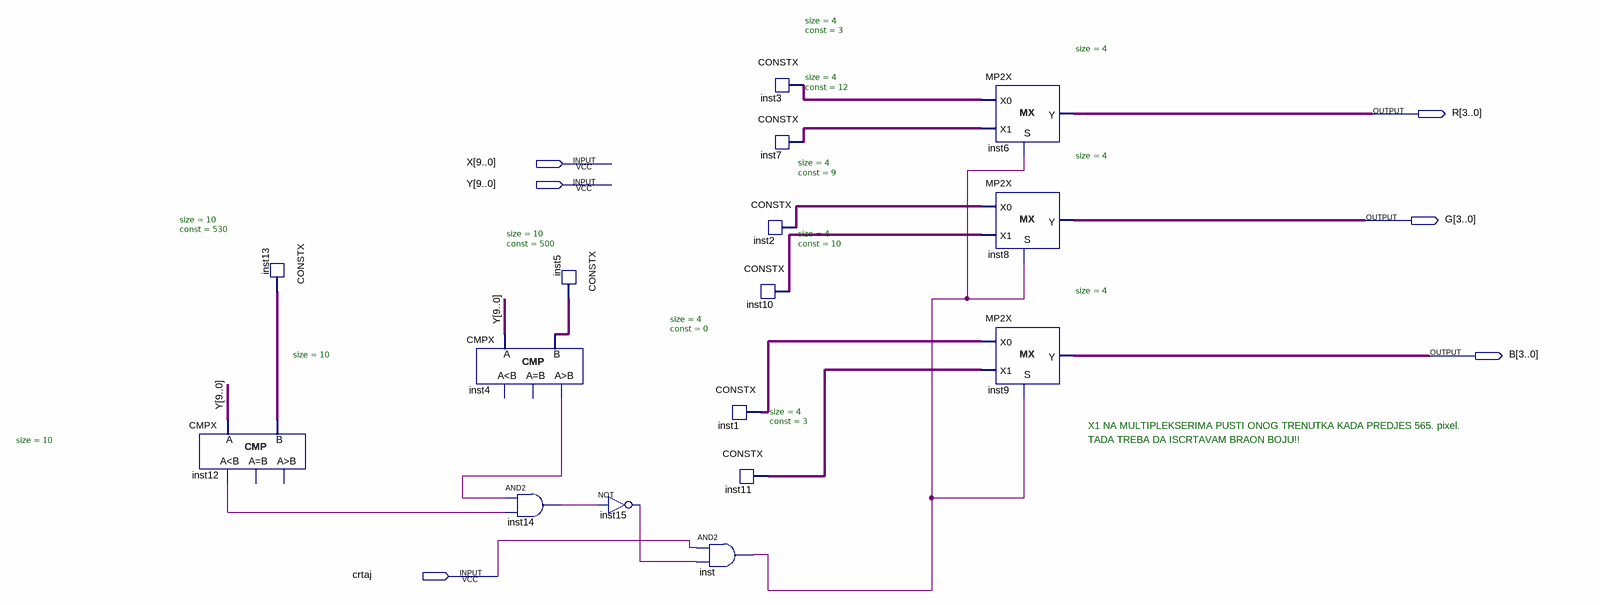
[diagram p0: schematic sheet]
// Quartus schematic Mesto_kretanja_loptice.bdf as structural Verilog: 16 symbols, 6 pins
module Mesto_kretanja_loptice (
  input  [9:0] X,
  input  [9:0] Y,
  input  crtaj,
  output [3:0] R,
  output [3:0] G,
  output [3:0] B
);

  wire inst4_gr, inst12_ls, inst14_out, inst15_out, inst_out;
  wire [3:0] inst1_data, inst2_data, inst3_data, inst7_data, inst10_data, inst11_data;
  wire [9:0] inst5_data, inst13_data;

  CMPX #(.size(10)) inst12 (.A(Y), .B(inst13_data), .ls(inst12_ls));  // open: eq, gr
  CONSTX #(.size(10), .\const (530)) inst13 (.data(inst13_data));
  CMPX #(.size(10)) inst4 (.A(Y), .B(inst5_data), .gr(inst4_gr));  // open: ls, eq
  CONSTX #(.size(10), .\const (500)) inst5 (.data(inst5_data));
  and inst14 (inst14_out, inst4_gr, inst12_ls);
  not inst15 (inst15_out, inst14_out);
  CONSTX #(.size(4), .\const (0)) inst1 (.data(inst1_data));
  CONSTX #(.size(4), .\const (3)) inst11 (.data(inst11_data));
  and inst (inst_out, crtaj, inst15_out);
  CONSTX #(.size(4), .\const (3)) inst3 (.data(inst3_data));
  CONSTX #(.size(4), .\const (12)) inst7 (.data(inst7_data));
  CONSTX #(.size(4), .\const (9)) inst2 (.data(inst2_data));
  CONSTX #(.size(4), .\const (10)) inst10 (.data(inst10_data));
  MP2X #(.size(4)) inst6 (.S(inst_out), .X0(inst3_data), .X1(inst7_data), .Y(R));
  MP2X #(.size(4)) inst8 (.S(inst_out), .X0(inst2_data), .X1(inst10_data), .Y(G));
  MP2X #(.size(4)) inst9 (.S(inst_out), .X0(inst1_data), .X1(inst11_data), .Y(B));

  // Notes on the sheet:
  //   X1 NA MULTIPLEKSERIMA PUSTI ONOG TRENUTKA KADA PREDJES 565. pixel.
  //   TADA TREBA DA ISCRTAVAM BRAON BOJU!!
endmodule
